# EAGLE design stm32f103_pin1 (EAGLE 6.3)
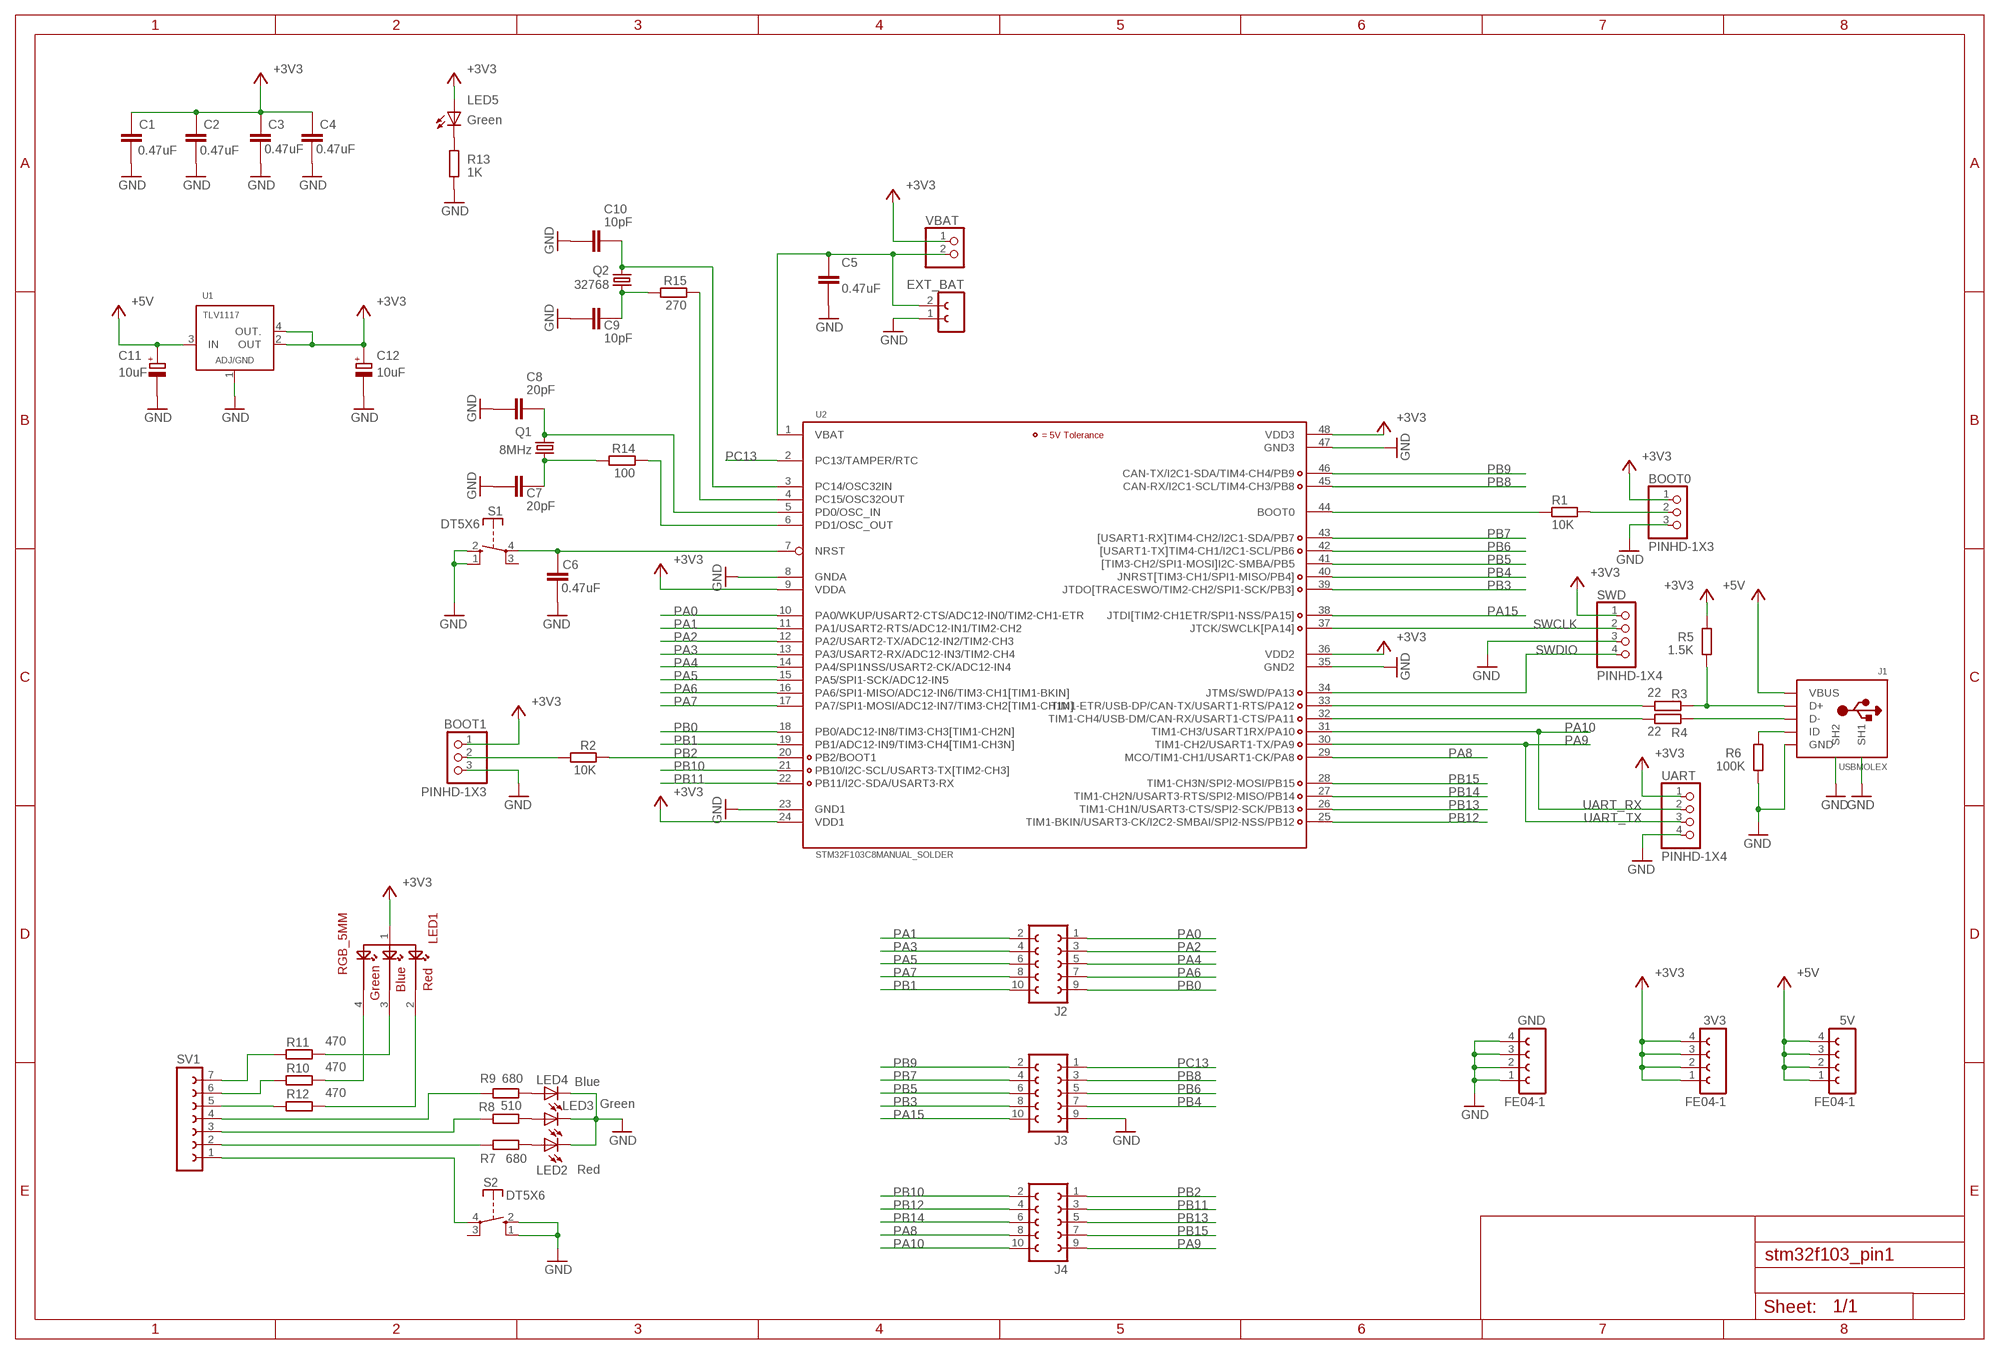
[diagram p0: schematic, sheet 1]

## Parts
3V3  FE04-1  [FE04-1]
5V  FE04-1  [FE04-1]
BOOT0  PINHD-1X3  [1X03]
BOOT1  PINHD-1X3  [1X03]
C1  0.47uF  CAPACITOR_0805  [CAPC2012X145AN]
C2  0.47uF  CAPACITOR_0805  [CAPC2012X145AN]
C3  0.47uF  CAPACITOR_0805  [CAPC2012X145AN]
C4  0.47uF  CAPACITOR_0805  [CAPC2012X145AN]
C5  0.47uF  CAPACITOR_0805  [CAPC2012X145AN]
C6  0.47uF  CAPACITOR_0805  [CAPC2012X145AN]
C7  20pF  CAPACITOR_0805  [CAPC2012X145AN]
C8  20pF  CAPACITOR_0805  [CAPC2012X145AN]
C9  10pF  CAPACITOR_0805  [CAPC2012X145AN]
C10  10pF  CAPACITOR_0805  [CAPC2012X145AN]
C11  10uF  POLARISED_A_CASE  [CAPMP3216X180N]
C12  10uF  POLARISED_A_CASE  [CAPMP3216X180N]
EXT_BAT  FE02-1  [FE02-1]
GND  FE04-1  [FE04-1]
J1  USBMOLEX  [HW-MU-5F-20]
J2  FE05-2  [FE05-2]
J3  FE05-2  [FE05-2]
J4  FE05-2  [FE05-2]
LED1  RGB_5MM  [RGB_5MM]
LED2  Red  LEDCHIP-LED0805  [CHIP-LED0805]
LED3  Green  LEDCHIP-LED0805  [CHIP-LED0805]
LED4  Blue  LEDCHIP-LED0805  [CHIP-LED0805]
LED5  Green  LEDCHIP-LED0805  [CHIP-LED0805]
Q1  8MHz  CRYSTALHC49S  [HC49/S]
Q2  32768  CRYSTALTC38H  [TC38H]
R1  10K  RESISTOR_0805  [RESC2012X70N]
R2  10K  RESISTOR_0805  [RESC2012X70N]
R3  22  RESISTOR_0805  [RESC2012X70N]
R4  22  RESISTOR_0805  [RESC2012X70N]
R5  1.5K  RESISTOR_0805  [RESC2012X70N]
R6  100K  RESISTOR_0805  [RESC2012X70N]
R7  680  RESISTOR_0805  [RESC2012X70N]
R8  510  RESISTOR_0805  [RESC2012X70N]
R9  680  RESISTOR_0805  [RESC2012X70N]
R10  470  RESISTOR_0805  [RESC2012X70N]
R11  470  RESISTOR_0805  [RESC2012X70N]
R12  470  RESISTOR_0805  [RESC2012X70N]
R13  1K  RESISTOR_0805  [RESC2012X70N]
R14  100  RESISTOR_0805  [RESC2012X70N]
R15  270  RESISTOR_0805  [RESC2012X70N]
S1  DT5X6  [TACTILE-PTH]
S2  DT5X6  [TACTILE-PTH]
SV1  FE07-1  [FE07]
SWD  PINHD-1X4  [1X04]
U1  TLV1117  [SOT223-4]
U2  STM32F103C8MANUAL_SOLDER  [LQFP48_IGORL]
UART  PINHD-1X4  [1X04]
VBAT  PINHD-1X2  [1X02]

## Nets
+3V3: 3V3.1 3V3.2 3V3.3 3V3.4 BOOT0.1 BOOT1.1 C1.1 C2.1 C3.1 C4.1 C12.+ LED1.1 LED5.A R5.2 SWD.1 U1.2(OUT) U1.4(OUT.) U2.9(VDDA) U2.24(VDD1) U2.36(VDD2) U2.48(VDD3) UART.1 VBAT.1
+5V: 5V.1 5V.2 5V.3 5V.4 C11.+ J1.VBUS U1.3(IN)
BOOT0: R1.1 U2.44(BOOT0)
BOOT1: BOOT1.2 R2.2
GND: BOOT0.3 BOOT1.3 C1.2 C2.2 C3.2 C4.2 C5.2 C6.2 C7.2 C8.2 C9.2 C10.2 C11.- C12.- EXT_BAT.1 GND.1 GND.2 GND.3 GND.4 J1.GND J1.SH1 J1.SH2 J3.9 LED2.C LED3.C LED4.C R6.2 R13.1 S1.1(S) S1.2(S) S2.1(S) S2.2(S) SWD.3 U1.1(ADJ/GND) U2.8(GNDA) U2.23(GND1) U2.35(GND2) U2.47(GND3) UART.4
N$1: R12.1 SV1.5
N$2: R15.1 U2.4(PC15/OSC32OUT)
N$3: C7.1 Q1.1 R14.2
N$4: C10.1 Q2.2 U2.3(PC14/OSC32IN)
N$5: C6.1 S1.4(P) U2.7(NRST)
N$7: C9.1 Q2.1 R15.2
N$8: BOOT0.2 R1.2
N$9: C8.1 Q1.2 U2.5(PD0/OSC_IN)
N$10: R14.1 U2.6(PD1/OSC_OUT)
N$11: LED5.C R13.2
N$12: J1.D+ R3.1 R5.1
N$13: J1.D- R4.1
N$15: J1.ID R6.1
N$16: S2.4(P) SV1.1
N$17: LED2.A R7.2
N$18: LED3.A R8.2
N$19: LED4.A R9.2
N$20: R7.1 SV1.2
N$21: R8.1 SV1.3
N$22: R9.1 SV1.4
N$23: LED1.2 R12.2
N$24: LED1.3 R11.2
N$25: LED1.4 R10.2
N$27: R10.1 SV1.6
N$28: R11.1 SV1.7
PA0: J2.1 U2.10(PA0/WKUP/USART2-CTS/ADC12-IN0/TIM2-CH1-ETR)
PA1: J2.2 U2.11(PA1/USART2-RTS/ADC12-IN1/TIM2-CH2)
PA2: J2.3 U2.12(PA2/USART2-TX/ADC12-IN2/TIM2-CH3)
PA3: J2.4 U2.13(PA3/USART2-RX/ADC12-IN3/TIM2-CH4)
PA4: J2.5 U2.14(PA4/SPI1NSS/USART2-CK/ADC12-IN4)
PA5: J2.6 U2.15(PA5/SPI1-SCK/ADC12-IN5)
PA6: J2.7 U2.16(PA6/SPI1-MISO/ADC12-IN6/TIM3-CH1[TIM1-BKIN])
PA7: J2.8 U2.17(PA7/SPI1-MOSI/ADC12-IN7/TIM3-CH2[TIM1-CH1N])
PA8: J4.8 U2.29(MCO/TIM1-CH1/USART1-CK/PA8)
PA9: J4.9 U2.30(TIM1-CH2/USART1-TX/PA9) UART.3
PA10: J4.10 U2.31(TIM1-CH3/USART1RX/PA10) UART.2
PA11: R4.2 U2.32(TIM1-CH4/USB-DM/CAN-RX/USART1-CTS/PA11)
PA12: R3.2 U2.33(TIM1-ETR/USB-DP/CAN-TX/USART1-RTS/PA12)
PA13: SWD.4 U2.34(JTMS/SWD/PA13)
PA14: SWD.2 U2.37(JTCK/SWCLK[PA14])
PA15: J3.10 U2.38(JTDI[TIM2-CH1ETR/SPI1-NSS/PA15])
PB0: J2.9 U2.18(PB0/ADC12-IN8/TIM3-CH3[TIM1-CH2N])
PB1: J2.10 U2.19(PB1/ADC12-IN9/TIM3-CH4[TIM1-CH3N])
PB2: J4.1 R2.1 U2.20(PB2/BOOT1)
PB3: J3.8 U2.39(JTDO[TRACESWO/TIM2-CH2/SPI1-SCK/PB3])
PB4: J3.7 U2.40(JNRST[TIM3-CH1/SPI1-MISO/PB4])
PB5: J3.6 U2.41([TIM3-CH2/SPI1-MOSI]I2C-SMBA/PB5)
PB6: J3.5 U2.42([USART1-TX]TIM4-CH1/I2C1-SCL/PB6)
PB7: J3.4 U2.43([USART1-RX]TIM4-CH2/I2C1-SDA/PB7)
PB8: J3.3 U2.45(CAN-RX/I2C1-SCL/TIM4-CH3/PB8)
PB9: J3.2 U2.46(CAN-TX/I2C1-SDA/TIM4-CH4/PB9)
PB10: J4.2 U2.21(PB10/I2C-SCL/USART3-TX[TIM2-CH3])
PB11: J4.3 U2.22(PB11/I2C-SDA/USART3-RX)
PB12: J4.4 U2.25(TIM1-BKIN/USART3-CK/I2C2-SMBAI/SPI2-NSS/PB12)
PB13: J4.5 U2.26(TIM1-CH1N/USART3-CTS/SPI2-SCK/PB13)
PB14: J4.6 U2.27(TIM1-CH2N/USART3-RTS/SPI2-MISO/PB14)
PB15: J4.7 U2.28(TIM1-CH3N/SPI2-MOSI/PB15)
PC13: J3.1 U2.2(PC13/TAMPER/RTC)
VBAT: C5.1 EXT_BAT.2 U2.1(VBAT) VBAT.2
Unconnected: S1.3(P) S2.3(P)

## Notes on the sheet
- SWCLK
- SWDIO
- UART_RX
- UART_TX

## Library data of the parts
3V3 5V GND = con-lsta:FE04-1: IGOR create
BOOT0 BOOT1 = pinhead:PINHD-1X3: PIN HEADER
C1-C10 = ipc-7351-capacitor:CAPACITOR_
C11 C12 = ipc-7351-capacitor:POLARISED_
EXT_BAT = con-lsta:FE02-1: IGOR create
J1 = jlab_connectors:USB: USB Connectors USBMINIB - Surface Mount Female Mini-B USB Connector 4UConnector: 06564 By microbuilder.eu Thru-hole RA Female Mini-B USB Connector 4UConnector: 18732 By ladyada.net
J2-J4 = con-lsta:FE05-2: FEMALE HEADER; OC_FARNELL: unknown; OC_NEWARK: unknown
LED1 = jlab:RGB_5MM
LED2-LED5 = jlab:LED: LED OSRAM: - CHIPLED LG R971, LG N971, LY N971, LG Q971, LY Q971, LO R971, LY R971 LH N974, LH R974 LS Q976, LO Q976, LY Q976 LO Q996 - Hyper CHIPLED LW Q18S LB Q993, LB Q99A, LB R99A - SideLED LS A670, LO A670, LY A670, LG A670, LP A670 LB A673, LV A673, LT A673, LW A673 LH A674 LY A675 LS A676, LA A676, LO A676, LY A676, LW A676 LS A679, LY A679, LG A679 - Hyper Micro SIDELED® LS Y876, LA Y876, LO Y876, LY Y876 LT Y87S - SmartLED LW L88C, LW L88S LB L89C, LB L89S, LG L890 LS L89K, LO L89K, LY L89K LS L896, LA L896, LO L896, LY L896 - TOPLED LS T670, LO T670, LY T670, LG T670, LP T670 LSG T670, LSP T670, LSY T670, LOP T670, LYG T670 LG T671, LOG T671, LSG T671 LB T673, LV T673, LT T673, LW T673 LH T674 LS T676, LA T676, LO T676, LY T676, LB T676, LH T676, LSB T676, LW T676 LB T67C, LV T67C, LT T67C, LS T67K, LO T67K, LY T67K, LW E67C LS E67B, LA E67B, LO E67B, LY E67B, LB E67C, LV E67C, LT E67C LW T67C LS T679, LY T679, LG T679 LS T770, LO T770, LY T770, LG T770, LP T770 LB T773, LV T773, LT T773, LW T773 LH T774 LS E675, LA E675, LY E675, LS T675 LS T776, LA T776, LO T776, LY T776, LB T776 LHGB T686 LT T68C, LB T68C - Hyper Mini TOPLED® LB M676 - Mini TOPLED Santana® LG M470 LS M47K, LO M47K, LY M47K Source: http://www.osram.convergy.de LUXEON: - LUMILED® LXK2-PW12-R00, LXK2-PW12-S00, LXK2-PW14-U00, LXK2-PW14-V00 LXK2-PM12-R00, LXK2-PM12-S00, LXK2-PM14-U00 LXK2-PE12-Q00, LXK2-PE12-R00, LXK2-PE12-S00, LXK2-PE14-T00, LXK2-PE14-U00 LXK2-PB12-K00, LXK2-PB12-L00, LXK2-PB12-M00, LXK2-PB14-N00, LXK2-PB14-P00, LXK2-PB14-Q00 LXK2-PR12-L00, LXK2-PR12-M00, LXK2-PR14-Q00, LXK2-PR14-R00 LXK2-PD12-Q00, LXK2-PD12-R00, LXK2-PD12-S00 LXK2-PH12-R00, LXK2-PH12-S00 LXK2-PL12-P00, LXK2-PL12-Q00, LXK2-PL12-R00 Source: www.luxeon.com KINGBRIGHT: KA-3528ASYC Source: www.kingbright.com
Q1 = crystal:CRYSTAL: CRYSTAL; OC_FARNELL: 1667008; OC_NEWARK: unknown
Q2 = SparkFun-FreqCtrl:CRYSTAL: Various standard crystals. Proven footprints. Spark Fun Electronics SKU : COM-00534
R1-R15 = ipc-7351-resistor:RESISTOR_
S1 S2 = jlab:DT: 5x5 push button
SV1 = con-lsta:FE07-1: FEMALE HEADER; OC_FARNELL: unknown; OC_NEWARK: unknown
SWD UART = pinhead:PINHD-1X4: PIN HEADER
U1 = ti-parts:TLV1117: LDO VOLTAGE REGULATOR
U2 = STM32_dhalt:STM32F103C8
VBAT = pinhead:PINHD-1X2: PIN HEADER

## Board
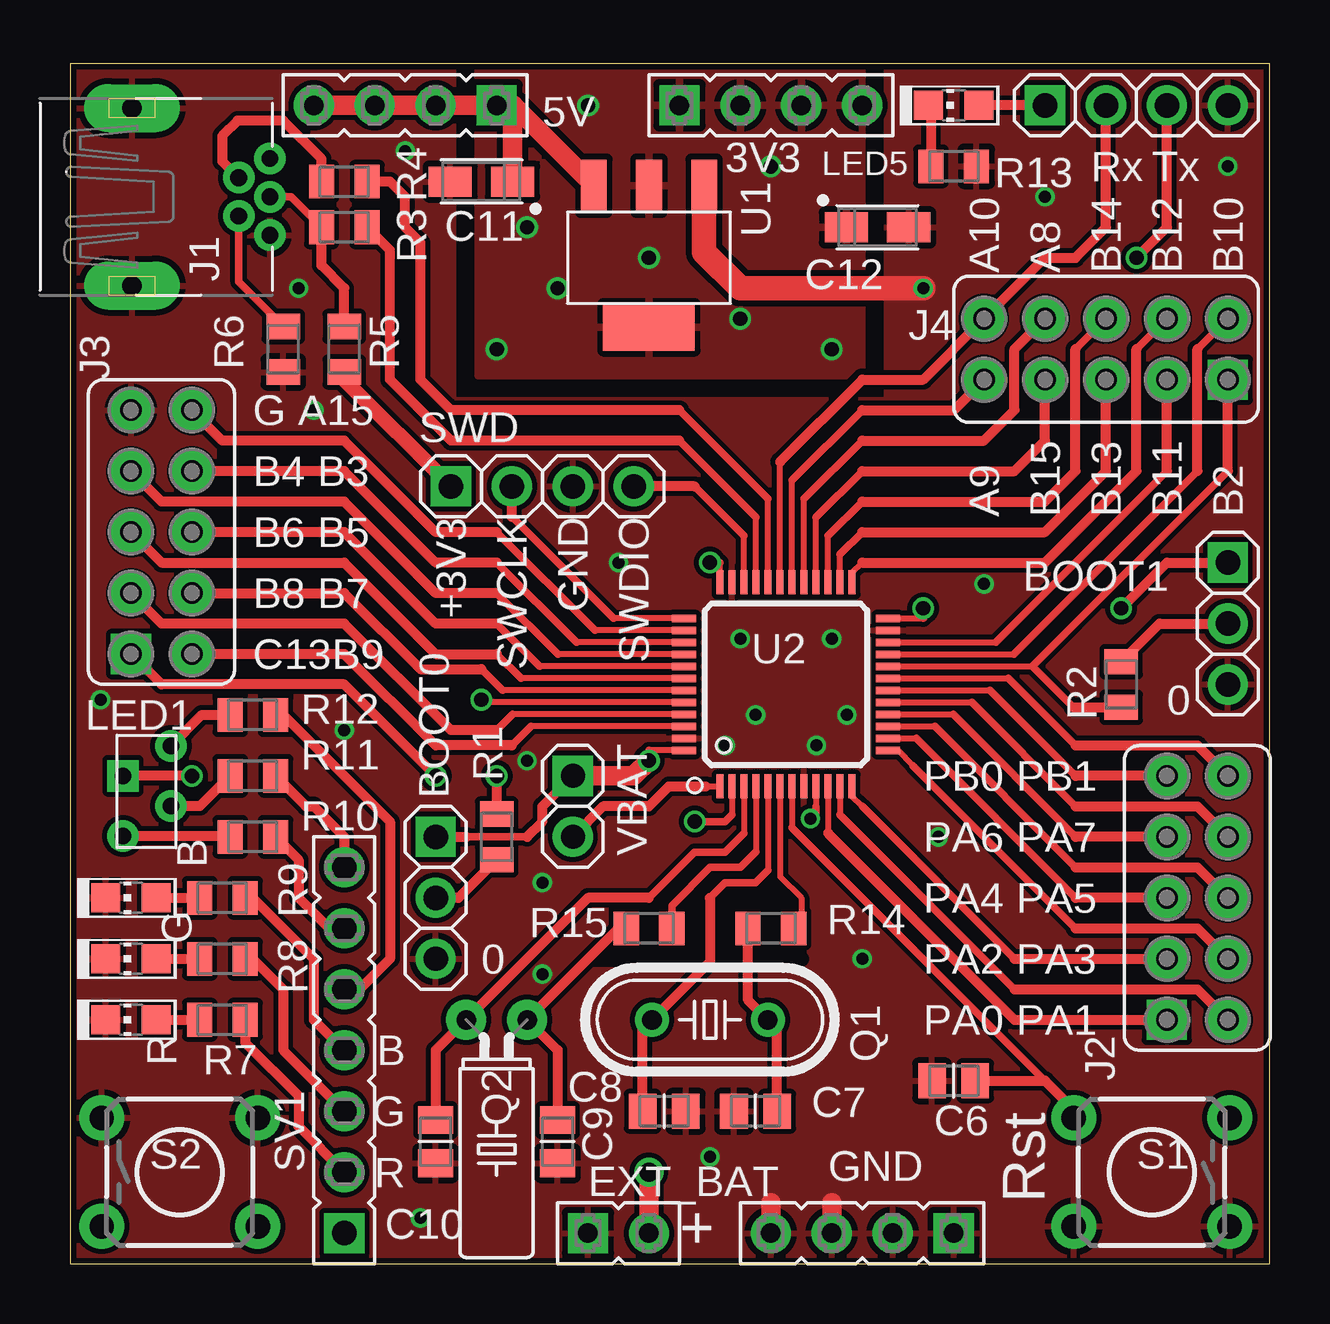
[diagram p1: board, top side]
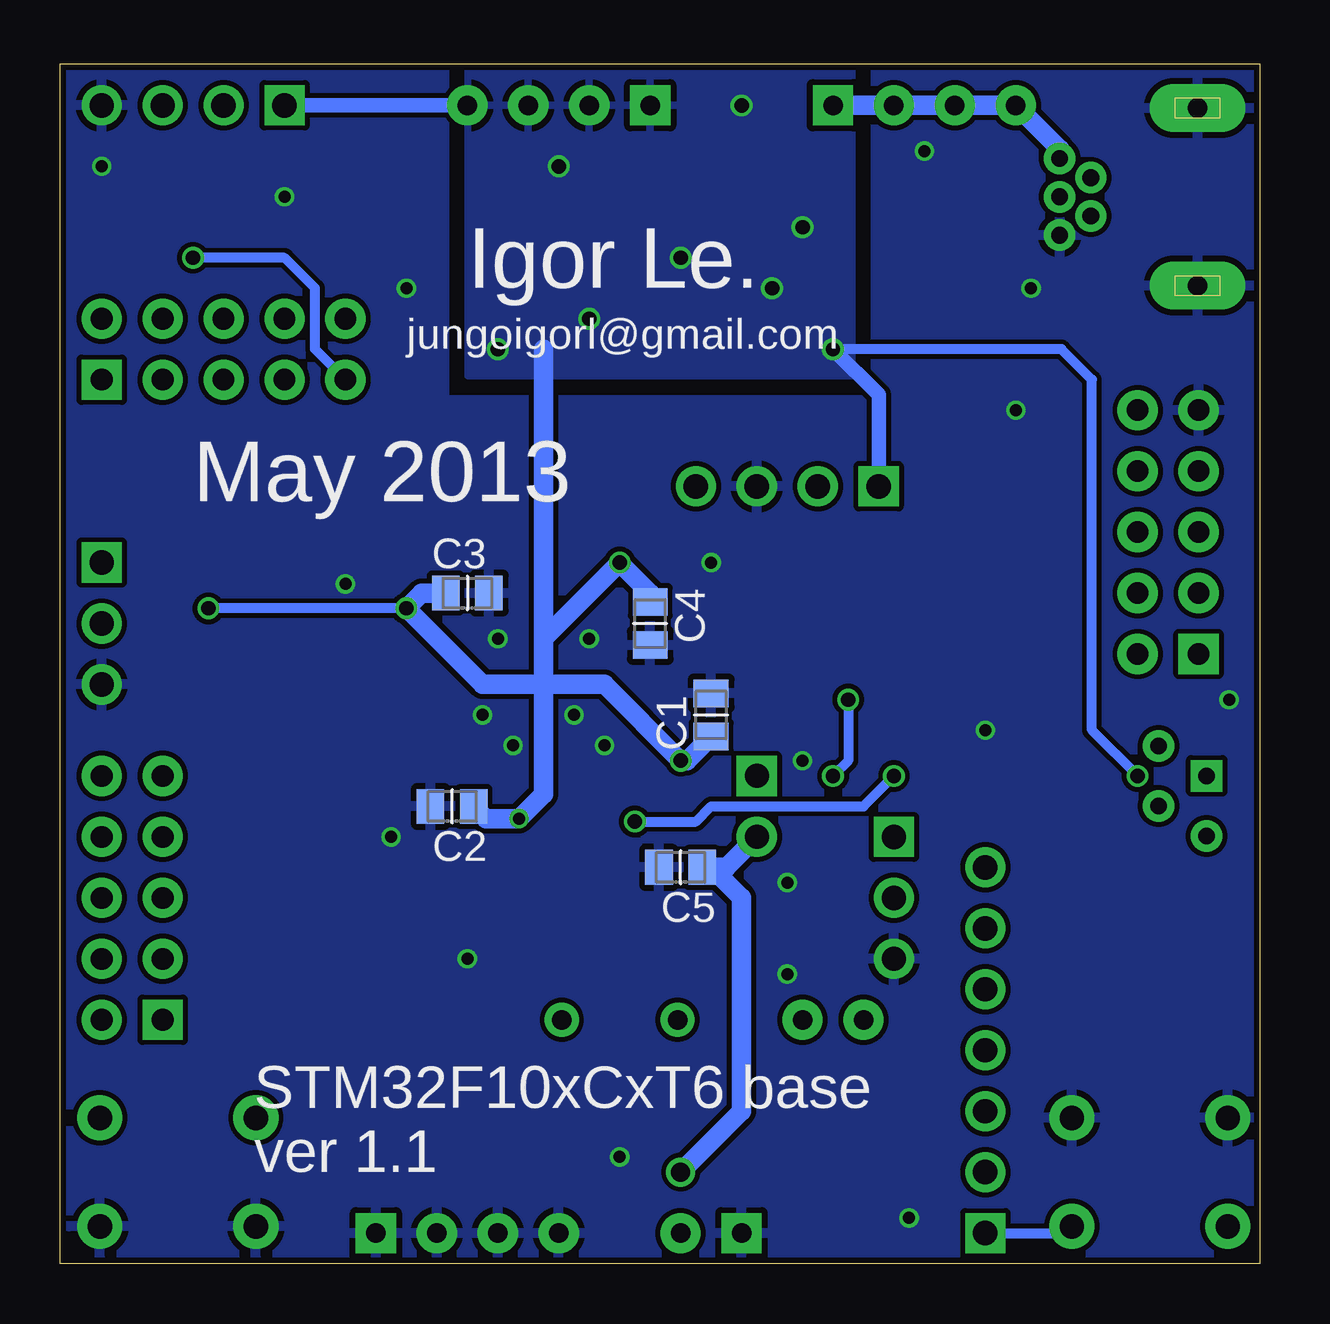
[diagram p2: board, bottom side, seen from below]

Size 50 x 50 mm. Coordinates in mm from the lower left corner, seen from the top.
Outline: 0,0 50,0 50,50 0,50 0,0
Copper layers (1*16): Top 0.035mm / dielectric 1.5mm / Bottom 0.035mm
Design rules "stm32f103_pin": minimum track width 10mil, minimum drill 0.6mm, track to track 8mil, track to pad 8mil, pad to pad 7mil, via to via 8mil, smd to smd 0mil, copper to edge 10mil, drill to drill 10mil, minimum pad ring 12mil, minimum via ring 6mil, stop-mask expansion 2mil, vias tented up to drill 40mil, thermal gap 10mil
tRestrict: 2 lines

### Footprints (pad centres in the part's own frame; a part is rotated, then mirrored left to right if it is on the bottom)
FE04-1 = drill 0.813 pad 1.676 square: 1 -3.81,0 | drill 0.813 pad 1.676: 2 -1.27,0; 3 1.27,0; 4 3.81,0
1X03 = drill 1.016 pad 1.676 square: 1 -2.54,0 | drill 1.016 pad 1.676: 2 0,0; 3 2.54,0
CAPC2012X145AN = smd 1.15 x 1.45: 1 -0.9,0; 2 0.9,0
CAPMP3216X180N = smd 1.8 x 1.25: + -1.3,0; - 1.3,0
FE02-1 = drill 0.813 pad 1.676 square: 1 -1.27,0 | drill 0.813 pad 1.676: 2 1.27,0
HW-MU-5F-20 = drill 0.7: D+ 0,9.6; D- -0.8,8.3; GND 1.6,9.6; ID 0.8,8.3; VBUS -1.6,9.6 | drill 0.8 pad 2 long: SH1 -3.7,3.85; SH2 3.7,3.85
FE05-2 = drill 0.9 pad 1.676 square: 1 -5.08,1.27 | drill 0.9 pad 1.676: 2 -5.08,-1.27; 3 -2.54,1.27; 4 -2.54,-1.27; 5 0,1.27; 6 0,-1.27; 7 2.54,1.27; 8 2.54,-1.27; 9 5.08,1.27; 10 5.08,-1.27
RGB_5MM = drill 0.7 square: 1 -0.969,1.27 | drill 0.7: 2 1.031,2.52; 3 1.031,0.02; 4 -0.969,-1.23
CHIP-LED0805 = smd 1.2 x 1.2: A 0,-1.05; C 0,1.05
HC49/S = drill 0.813: 1 -2.413,0; 2 2.413,0
TC38H = drill 0.813 pad 1.676: 1 -1.27,0; 2 1.27,0
RESC2012X70N = smd 1.05 x 1.4: 1 -0.95,0; 2 0.95,0
TACTILE-PTH = drill 1.016 pad 1.88: 1 -3.251,2.261; 2 3.251,2.261; 3 -3.251,-2.261; 4 3.251,-2.261
FE07 = drill 1.016 pad 1.676 square: 1 -7.62,0 | drill 1.016 pad 1.676: 2 -5.08,0; 3 -2.54,0; 4 0,0; 5 2.54,0; 6 5.08,0; 7 7.62,0
1X04 = drill 1.016 pad 1.676 square: 1 -3.81,0 | drill 1.016 pad 1.676: 2 -1.27,0; 3 1.27,0; 4 3.81,0
SOT223-4 = smd 1.067 x 2.184: 1 -2.3,-3; 2 0,-3; 3 2.3,-3 | smd 3.81 x 1.93: 4 0,2.9
LQFP48_IGORL = smd 0.3 x 1: 1 -2.75,-4.25; 2 -2.25,-4.25; 3 -1.75,-4.25; 4 -1.25,-4.25; 5 -0.75,-4.25; 6 -0.25,-4.25; 7 0.25,-4.25; 8 0.75,-4.25; 9 1.25,-4.25; 10 1.75,-4.25; 11 2.25,-4.25; 12 2.75,-4.25; 25 2.75,4.25; 26 2.25,4.25; 27 1.75,4.25; 28 1.25,4.25; 29 0.75,4.25; 30 0.25,4.25; 31 -0.25,4.25; 32 -0.75,4.25; 33 -1.25,4.25; 34 -1.75,4.25; 35 -2.25,4.25; 36 -2.75,4.25 | smd 1 x 0.3: 13 4.25,-2.75; 14 4.25,-2.25; 15 4.25,-1.75; 16 4.25,-1.25; 17 4.25,-0.75; 18 4.25,-0.25; 19 4.25,0.25; 20 4.25,0.75; 21 4.25,1.25; 22 4.25,1.75; 23 4.25,2.25; 24 4.25,2.75; 37 -4.25,2.75; 38 -4.25,2.25; 39 -4.25,1.75; 40 -4.25,1.25; 41 -4.25,0.75; 42 -4.25,0.25; 43 -4.25,-0.25; 44 -4.25,-0.75; 45 -4.25,-1.25; 46 -4.25,-1.75; 47 -4.25,-2.25; 48 -4.25,-2.75
1X02 = drill 1 pad 1.676 square: 1 -1.27,0 | drill 1 pad 1.676: 2 1.27,0

### Placement (x,y rotation side)
3V3  29.21,48.26 0 top
5V  13.97,48.26 180 top
BOOT0  15.24,15.24 270 top
BOOT1  48.26,26.67 270 top
C1  22.86,22.86 90 bottom
C2  33.66,19.05 180 bottom
C3  33.02,27.94 0 bottom
C4  25.4,26.67 270 bottom
C5  24.13,16.51 180 bottom
C6  36.83,7.62 180 top
C7  28.57,6.35 180 top
C8  24.77,6.35 0 top
C9  20.32,5.08 270 top
C10  15.24,5.08 270 top
C11  17.14,45.09 180 top
C12  33.66,43.18 0 top
EXT_BAT  22.86,1.27 0 top
GND  33.02,1.27 180 top
J1  -1.27,44.45 270 top
J2  46.99,15.24 90 top
J3  3.81,30.48 90 top
J4  43.18,38.1 180 top
LED1  3.17,19.05 0 top
LED2  2.54,10.16 90 top
LED3  2.54,12.7 90 top
LED4  2.54,15.24 90 top
LED5  36.83,48.26 90 top
Q1  26.67,10.16 180 top
Q2  17.78,10.16 180 top
R1  17.78,17.78 270 top
R2  43.81,24.13 90 top
R3  11.43,43.18 0 top
R4  11.43,45.09 0 top
R5  11.43,38.1 270 top
R6  8.89,38.1 270 top
R7  6.35,10.16 180 top
R8  6.35,12.7 180 top
R9  6.35,15.24 180 top
R10  7.62,17.78 180 top
R11  7.62,20.32 180 top
R12  7.62,22.86 180 top
R13  36.83,45.72 180 top
R14  29.21,13.97 180 top
R15  24.13,13.97 180 top
S1  45.09,3.81 180 top
S2  4.57,3.81 0 top
SV1  11.43,8.89 90 top
SWD  19.68,32.38 0 top
U1  24.13,41.91 180 top
U2  29.84,24.13 0 top
UART  44.45,48.26 0 top
VBAT  20.95,19.05 270 top

### Tracks (layer width: path | path; a pad name or v marks a point on that pad's centre or on a via)
+3V3  (via drill 0.5, 0.6)
  Top 0.254: U2.9 31.09,19.03 | U2.24 35.56,26.88 | U2.36 27.09,29.21 | U2.48 24.13,21.38
  Top 0.305: 35.56,26.88 v35.56,27.3 | 27.09,29.21 v26.67,29.21 | 24.13,21.38 v24.13,20.95 | 16.51,17.78 19.05,17.78 | v30.86,18.54 31.09,18.78 31.09,19.03
  Top 0.406: v43.81,27.3 45.72,29.21 BOOT1.1 | UART.1 LED5.A | BOOT0.1 16.51,17.78 | 19.05,17.78 19.68,18.41 19.68,19.05 VBAT.1 | v5.08,20.32 LED1.1
  Top 0.61: SWD.1 11.43,36.83 R5.2
  Top 0.813: v24.13,20.95 23.5,20.32 VBAT.1
  Bottom 0.406: v35.56,27.3 v43.81,27.3 | v5.08,20.32 6.99,22.23 6.99,36.83 8.26,38.1 v17.78,38.1
  Bottom 0.61: 3V3.4 UART.1 | v17.78,38.1 15.88,36.2 SWD.1
  Bottom 0.813: 29.84,26.04 29.84,38.1 | 29.84,24.13 32.38,24.13 v35.56,27.3 34.92,27.94 C3.1 | 29.84,24.13 29.84,19.56 v30.86,18.54 32.25,18.54 C2.1 | 29.84,24.13 27.3,24.13 v24.13,20.95 23.86,20.95 C1.1 | 29.84,24.13 29.84,26.04 | 29.84,26.04 v26.67,29.21 25.4,27.94 C4.1
  other vias: 20.32,40.64 19.05,43.18 21.59,48.26 24.13,41.91 29.21,45.72 27.94,39.37 31.75,38.1
  pour Top (isolate 0.254): 17,50 17,37 33,37 33,50
  pour Bottom (isolate 0.254): 17,50 17,37 33,37 33,50
+5V
  Top 0.813: 5V.1 5V.2 5V.3 5V.4 | U1.3 18.48,48.26 5V.1 | C11.+ 18.45,46.99 18.45,47.59 5V.1
  Bottom 0.813: 5V.1 5V.2 5V.3 5V.4 8.33,46.43 J1.VBUS
BOOT0  (via drill 0.6)
  Top 0.254: U2.44 17.26,23.38 v17.14,23.5
  Top 0.406: v17.78,20.32 R1.1
  Bottom 0.406: v17.14,23.5 17.14,20.95 v17.78,20.32
BOOT1
  Top 0.406: R2.2 45.41,26.67 BOOT1.2
GND  (via drill 0.5)
  Top 0.813: GND.4 29.21,2.54 | GND.3 31.75,2.54
  Top 1.016: U1.1 26.43,42.15 27.94,40.64 v35.56,40.64
  other vias: 13.97,46.35 9.53,40.64 22.86,29.21 40.64,44.45 48.26,45.72 31.75,26.04 31.11,21.59 32.38,22.86 27.94,26.04 28.57,22.86 27.3,21.59 38.1,28.32 36.2,17.78 33.02,12.7 26.67,4.45 14.61,1.91 1.27,23.5 11.43,22.23 19.68,12.06 19.05,20.95 19.68,15.88 10.16,35.56
  pour Bottom: 0,0 50,0 50,50 34,50 34,36 16,36 16,50 0,50
  pour Top (isolate 0.203): 0,0 50,0 50,50 34,50 34,36 16,36 16,50 0,50
N$1
  Top 0.406: R12.1 8.89,22.86 13.34,18.41 13.34,12.7 12.06,11.43 SV1.5
N$2
  Top 0.254: U2.4 28.59,17.16
  Top 0.305: 28.59,17.16 27.94,16.51 26.67,16.51 25.08,14.92 R15.1
N$3
  Top 0.305: 29.48,9.77 Q1.1
  Top 0.406: C7.1 29.48,9.77 | Q1.1 28.26,10.98 R14.2
N$4
  Top 0.254: U2.3 28.09,17.93
  Top 0.305: 28.09,17.93 27.3,17.14 26.04,17.14 24.13,15.24
  Top 0.406: C10.1 15.24,8.89 Q2.2 21.59,15.24 24.13,15.24
N$5
  Top 0.254: U2.7 30.09,18.16
  Top 0.305: 30.09,18.16 40.64,7.62
  Top 0.406: C6.1 40.64,7.62 41.91,6.35 41.91,6.15 S1.4
N$7
  Top 0.406: C9.1 20.32,8.89 Q2.1 22.86,13.97 R15.2
N$8
  Top 0.406: R1.2 16.19,15.24 BOOT0.2
N$9
  Top 0.254: U2.5 29.09,16.39
  Top 0.305: 23.86,9.77 Q1.2 | 29.09,16.39 28.57,15.88 27.3,15.88 26.67,15.24
  Top 0.406: Q1.2 26.67,12.57 26.67,15.24 | C8.1 23.86,9.77
N$10
  Top 0.254: U2.6 29.59,16.12 30.48,15.24 30.48,14.29 R14.1
N$11
  Top 0.406: LED5.C 35.88,48.26 R13.2
N$12
  Top 0.305: R3.1 9.21,44.45 J1.D+
  Top 0.406: R5.1 11.43,40.64 10.48,41.59 R3.1
N$13
  Top 0.406: R4.1 10.48,46.03 8.89,47.62 6.99,47.62 6.35,46.99 6.35,45.93 J1.D-
N$15
  Top 0.305: R6.1 7.03,40.91 J1.ID
N$16
  Bottom 0.406: SV1.1 8.1,1.27 S2.4
N$17
  Top 0.406: LED2.A R7.2
N$18
  Top 0.406: LED3.A R8.2
N$19
  Top 0.406: LED4.A R9.2
N$20
  Top 0.406: R7.1 7.3,9.21 9.53,6.99 9.53,5.71 SV1.2
N$21
  Top 0.406: R8.1 7.62,12.7 8.89,11.43 8.89,8.89 SV1.3
N$22
  Top 0.406: R9.1 7.62,15.24 10.16,12.7 10.16,10.16 SV1.4
N$23
  Top 0.406: LED1.2 5.5,22.86 R12.2
N$24
  Top 0.406: LED1.3 5.42,19.07 R11.2
N$25
  Top 0.406: LED1.4 6.63,17.82 R10.2
N$27
  Top 0.406: R10.1 9.53,16.82 9.53,15.24 10.79,13.97 SV1.6
N$28
  Top 0.406: R11.1 9.84,19.05 10.16,19.05 11.43,17.78 SV1.7
PA0
  Top 0.254: U2.10 31.59,17.93
  Top 0.406: 31.59,17.93 39.37,10.16 J2.1
PA1
  Top 0.254: U2.11 32.09,18.7
  Top 0.305: 32.09,18.7 39.37,11.43
  Top 0.406: 39.37,11.43 46.99,11.43 J2.2
PA2
  Top 0.254: 33.02,19.05 32.59,19.48 U2.12
  Top 0.305: 39.37,12.7 33.02,19.05
  Top 0.406: 39.37,12.7 J2.3
PA3
  Top 0.254: 35.13,20.75 34.5,21.38 U2.13
  Top 0.305: 35.13,20.75 41.91,13.97
  Top 0.406: 41.91,13.97 46.99,13.97 J2.4
PA4
  Top 0.254: U2.14 35.27,21.88
  Top 0.305: 35.27,21.88 41.91,15.24
  Top 0.406: J2.5 41.91,15.24
PA5
  Top 0.254: U2.15 36.04,22.38
  Top 0.305: 36.04,22.38 41.91,16.51
  Top 0.406: 41.91,16.51 46.99,16.51 J2.6
PA6
  Top 0.254: U2.16 36.81,22.88
  Top 0.305: 36.81,22.88 41.91,17.78
  Top 0.406: J2.7 41.91,17.78
PA7
  Top 0.254: U2.17 37.58,23.38
  Top 0.305: 37.58,23.38 41.91,19.05
  Top 0.406: 41.91,19.05 46.99,19.05 J2.8
PA8
  Top 0.254: U2.29 30.59,31.86
  Top 0.305: 30.59,31.86 33.02,34.29
  Top 0.406: J4.8 39.37,38.1 39.37,35.56 38.1,34.29 33.02,34.29
PA9  (via drill 0.6)
  Top 0.254: U2.30 30.09,32.63
  Top 0.305: 30.09,32.63 33.02,35.56
  Top 0.406: 33.02,35.56 36.83,35.56 J4.9 | v44.45,41.91 45.72,43.18 UART.3
  Bottom 0.406: J4.9 39.37,38.1 39.37,40.64 40.64,41.91 v44.45,41.91
PA10
  Top 0.254: U2.31 29.59,33.41
  Top 0.406: 29.59,33.41 33.02,36.83 35.56,36.83 J4.10 40.64,41.91 41.91,41.91 43.18,43.18 UART.2
PA11
  Top 0.254: U2.32 29.09,31.86
  Top 0.305: 29.09,31.86 25.4,35.56
  Top 0.406: R4.2 13.34,45.09 13.97,44.45 13.97,43.18 14.61,42.55 14.61,36.83 15.88,35.56 25.4,35.56
PA12
  Top 0.254: U2.33 28.59,31.09
  Top 0.305: 28.59,31.09 25.4,34.29
  Top 0.406: R3.2 13.34,42.23 13.34,36.83 15.88,34.29 25.4,34.29
PA13
  Top 0.254: U2.34 28.09,30.32
  Top 0.305: 28.09,30.32 26.04,32.38
  Top 0.406: 26.04,32.38 SWD.4
PA14
  Top 0.254: U2.37 22.65,26.88
  Top 0.305: 22.65,26.88 18.41,31.11
  Top 0.406: 18.41,31.11 SWD.2
PA15
  Top 0.254: U2.38 21.88,26.38
  Top 0.305: 21.88,26.38 17.78,30.48
  Top 0.406: 17.78,30.48 15.24,30.48 11.43,34.29 6.35,34.29 J3.10
PB0
  Top 0.254: U2.18 38.35,23.88
  Top 0.305: 38.35,23.88 41.91,20.32
  Top 0.406: J2.9 41.91,20.32
PB1
  Top 0.254: U2.19 39.12,24.38
  Top 0.305: 39.12,24.38 41.91,21.59
  Top 0.406: 41.91,21.59 46.99,21.59 J2.10
PB2
  Top 0.254: U2.20 40.12,24.88
  Top 0.305: 48.26,33.02 40.12,24.88 41.82,23.18
  Top 0.406: 48.26,33.02 J4.1 | 41.82,23.18 R2.1
PB3
  Top 0.254: U2.39 21.11,25.88
  Top 0.305: 21.11,25.88 17.78,29.21
  Top 0.406: 17.78,29.21 15.24,29.21 11.43,33.02 J3.8
PB4
  Top 0.254: U2.40 20.34,25.38
  Top 0.305: 20.34,25.38 17.78,27.94
  Top 0.406: J3.7 3.81,31.75 11.43,31.75 15.24,27.94 17.78,27.94
PB5
  Top 0.254: U2.41 19.57,24.88
  Top 0.305: 19.57,24.88 17.78,26.67
  Top 0.406: 17.78,26.67 15.24,26.67 11.43,30.48 J3.6
PB6
  Top 0.254: U2.42 18.8,24.38
  Top 0.305: 17.78,25.4 18.8,24.38
  Top 0.406: J3.5 3.81,29.21 11.43,29.21 15.24,25.4 17.78,25.4
PB7
  Top 0.254: U2.43 18.03,23.88
  Top 0.305: 17.14,24.77 18.03,23.88
  Top 0.406: J3.4 11.43,27.94 14.61,24.77 17.14,24.77
PB8
  Top 0.254: U2.45 18.43,22.88
  Top 0.305: 18.43,22.88 17.78,22.23
  Top 0.406: 17.78,22.23 15.88,22.23 11.43,26.67 3.81,26.67 J3.3
PB9
  Top 0.254: U2.46 19.2,22.38
  Top 0.305: 19.2,22.38 18.41,21.59
  Top 0.406: 18.41,21.59 15.24,21.59 11.43,25.4 J3.2
PB10
  Top 0.254: U2.21 39.35,25.38
  Top 0.305: 39.35,25.38 46.99,33.02 | 46.99,38.1 J4.2
  Top 0.406: 46.99,33.02 46.99,38.1
PB11
  Top 0.254: U2.22 38.58,25.88
  Top 0.305: 38.58,25.88 45.72,33.02
  Top 0.406: 45.72,33.02 J4.3
PB12
  Top 0.254: U2.25 32.59,28.79 33.02,29.21
  Top 0.305: 44.45,38.1 J4.4
  Top 0.406: 33.02,29.21 40.64,29.21 44.45,33.02 44.45,38.1
PB13
  Top 0.254: U2.26 32.09,29.55
  Top 0.305: 32.09,29.55 33.02,30.48
  Top 0.406: 33.02,30.48 40.64,30.48 43.18,33.02 J4.5
PB14
  Top 0.254: U2.27 31.59,30.32
  Top 0.305: 31.59,30.32 33.02,31.75 | 41.91,38.1 J4.6
  Top 0.406: 33.02,31.75 40.64,31.75 41.91,33.02 41.91,38.1
PB15
  Top 0.254: U2.28 31.09,31.09
  Top 0.305: 31.09,31.09 33.02,33.02
  Top 0.406: 33.02,33.02 39.37,33.02 40.64,34.29 J4.7
PC13  (via drill 0.6)
  Top 0.254: 27.59,19.98 U2.2 27.59,18.7
  Top 0.305: 27.59,18.7 27.3,18.41 v26.04,18.41
  Top 0.406: v15.24,20.32 11.43,24.13 3.81,24.13 J3.1
  Bottom 0.406: v26.04,18.41 23.5,18.41 22.86,19.05 16.51,19.05 v15.24,20.32
VBAT  (via drill 0.8)
  Top 0.254: 26.5,19.88 U2.1
  Top 0.406: VBAT.2 22.23,19.05 24.13,19.05 24.96,19.88 26.5,19.88
  Top 0.813: v24.13,3.81 EXT_BAT.2
  Bottom 0.813: 22.86,16.51 22.23,16.51 VBAT.2 | 22.86,16.51 21.59,15.24 21.59,6.35 v24.13,3.81 | 22.86,16.51 C5.1

### Text on the board
tNames: Rx | Tx | A10 / A8 / B14 / B12 / B10 | +3V3 / SWCLK / GND / SWDIO | A9 / B15 / B13 / B11 / B2 | G A15 / B4 B3 / B6 B5 / B8 B7 / C13B9 | 0 | B | G | 0 | B | PB0 PB1 / PA6 PA7 / PA4 PA5 / PA2 PA3 / PA0 PA1 | R | G | R | Rst | +
bNames: Igor Le. | jungoigorl@gmail.com | May 2013 | STM32F10xCxT6 base / ver 1.1